# EAGLE schematic Umwandlung 1.8 to 5 (EAGLE 6.4)
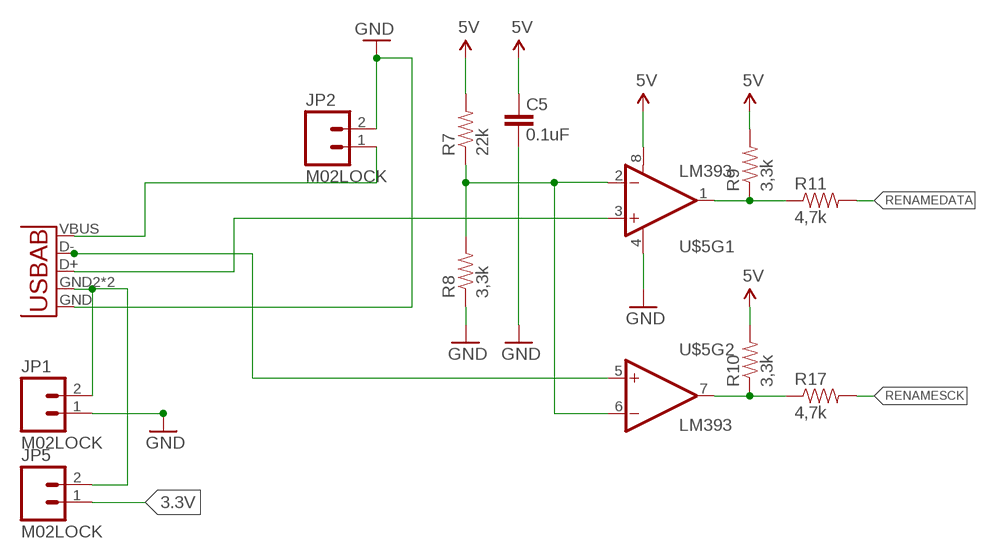
[diagram p0: schematic, sheet 1]

## Parts
C5  0.1uF  CAP0805  [0805]
JP1  M02LOCK  [1X02_LOCK]
JP2  M02LOCK  [1X02_LOCK]
JP5  M02LOCK  [1X02_LOCK]
R7  22k  RESISTOR  [0805]
R8  3,3k  RESISTOR  [0805]
R9  3,3k  RESISTOR  [0805]
R10  3,3k  RESISTOR  [0805]
R11  4,7k  RESISTOR  [0805]
R17  4,7k  RESISTOR  [0805]
U$5  LM393  [SO08]
U$7  USB-A  [USB-A]

## Nets
3.3V: JP5.1
5V: C5.2 R7.2 R9.2 R10.2 U$5.8(V+)
DATA1: R9.1 R11.1 U$5.1(OUT)
GND [vcc]: C5.1 JP1.1 JP2.2 R8.1 U$5.4(V-) U$7.GND
N$3: JP2.1 U$7.VBUS
N$9: R7.1 R8.2 U$5.2(-IN) U$5.6(-IN)
N$10: U$5.3(+IN) U$7.D+
N$11: U$5.5(+IN) U$7.D-
N$15: JP1.2 JP5.2 U$7.GND2(USBID) U$7.GND3(USBID)
RENAMEDATA: R11.2
RENAMESCK: R17.2
SCK1: R10.1 R17.1 U$5.7(OUT)

## Library data of the parts
C5 = SparkFun:CAP: Capacitor Standard 0603 ceramic capacitor, and 0.1" leaded capacitor.
JP1 JP2 JP5 = SparkFun-Connectors:M02: Standard 2-pin 0.1" header. Use with - straight break away headers ( PRT-00116) - right angle break away headers (PRT-00553) - swiss pins (PRT-00743) - machine pins (PRT-00117) - female headers (PRT-00115) Molex polarized connector foot print use with: PRT-08233 with associated crimp pins and housings. 2.54_SCREWTERM for use with PRT-10571. 3.5mm Screw Terminal footprints for PRT-08084 5mm Screw Terminal footprints for use with PRT-08433
R7-R11 R17 = SparkFun:RESISTOR: Resistor Basic schematic elements and footprints for 0603, 1206, and PTH 1/10th watt (small) resistors.
U$5 = SparkFun-AnalogIC:LM393: Low-voltage comparator
U$7 = andi:USB-A

## Net classes
0 default: width 0.203 mm, clearance 0.205 mm
1 vcc: width 0.254 mm, clearance 0.205 mm to class 0, clearance 0.205 mm